# EAGLE board ArduinoDevBoardRevA (EAGLE 8.7.1), part 1 of 2
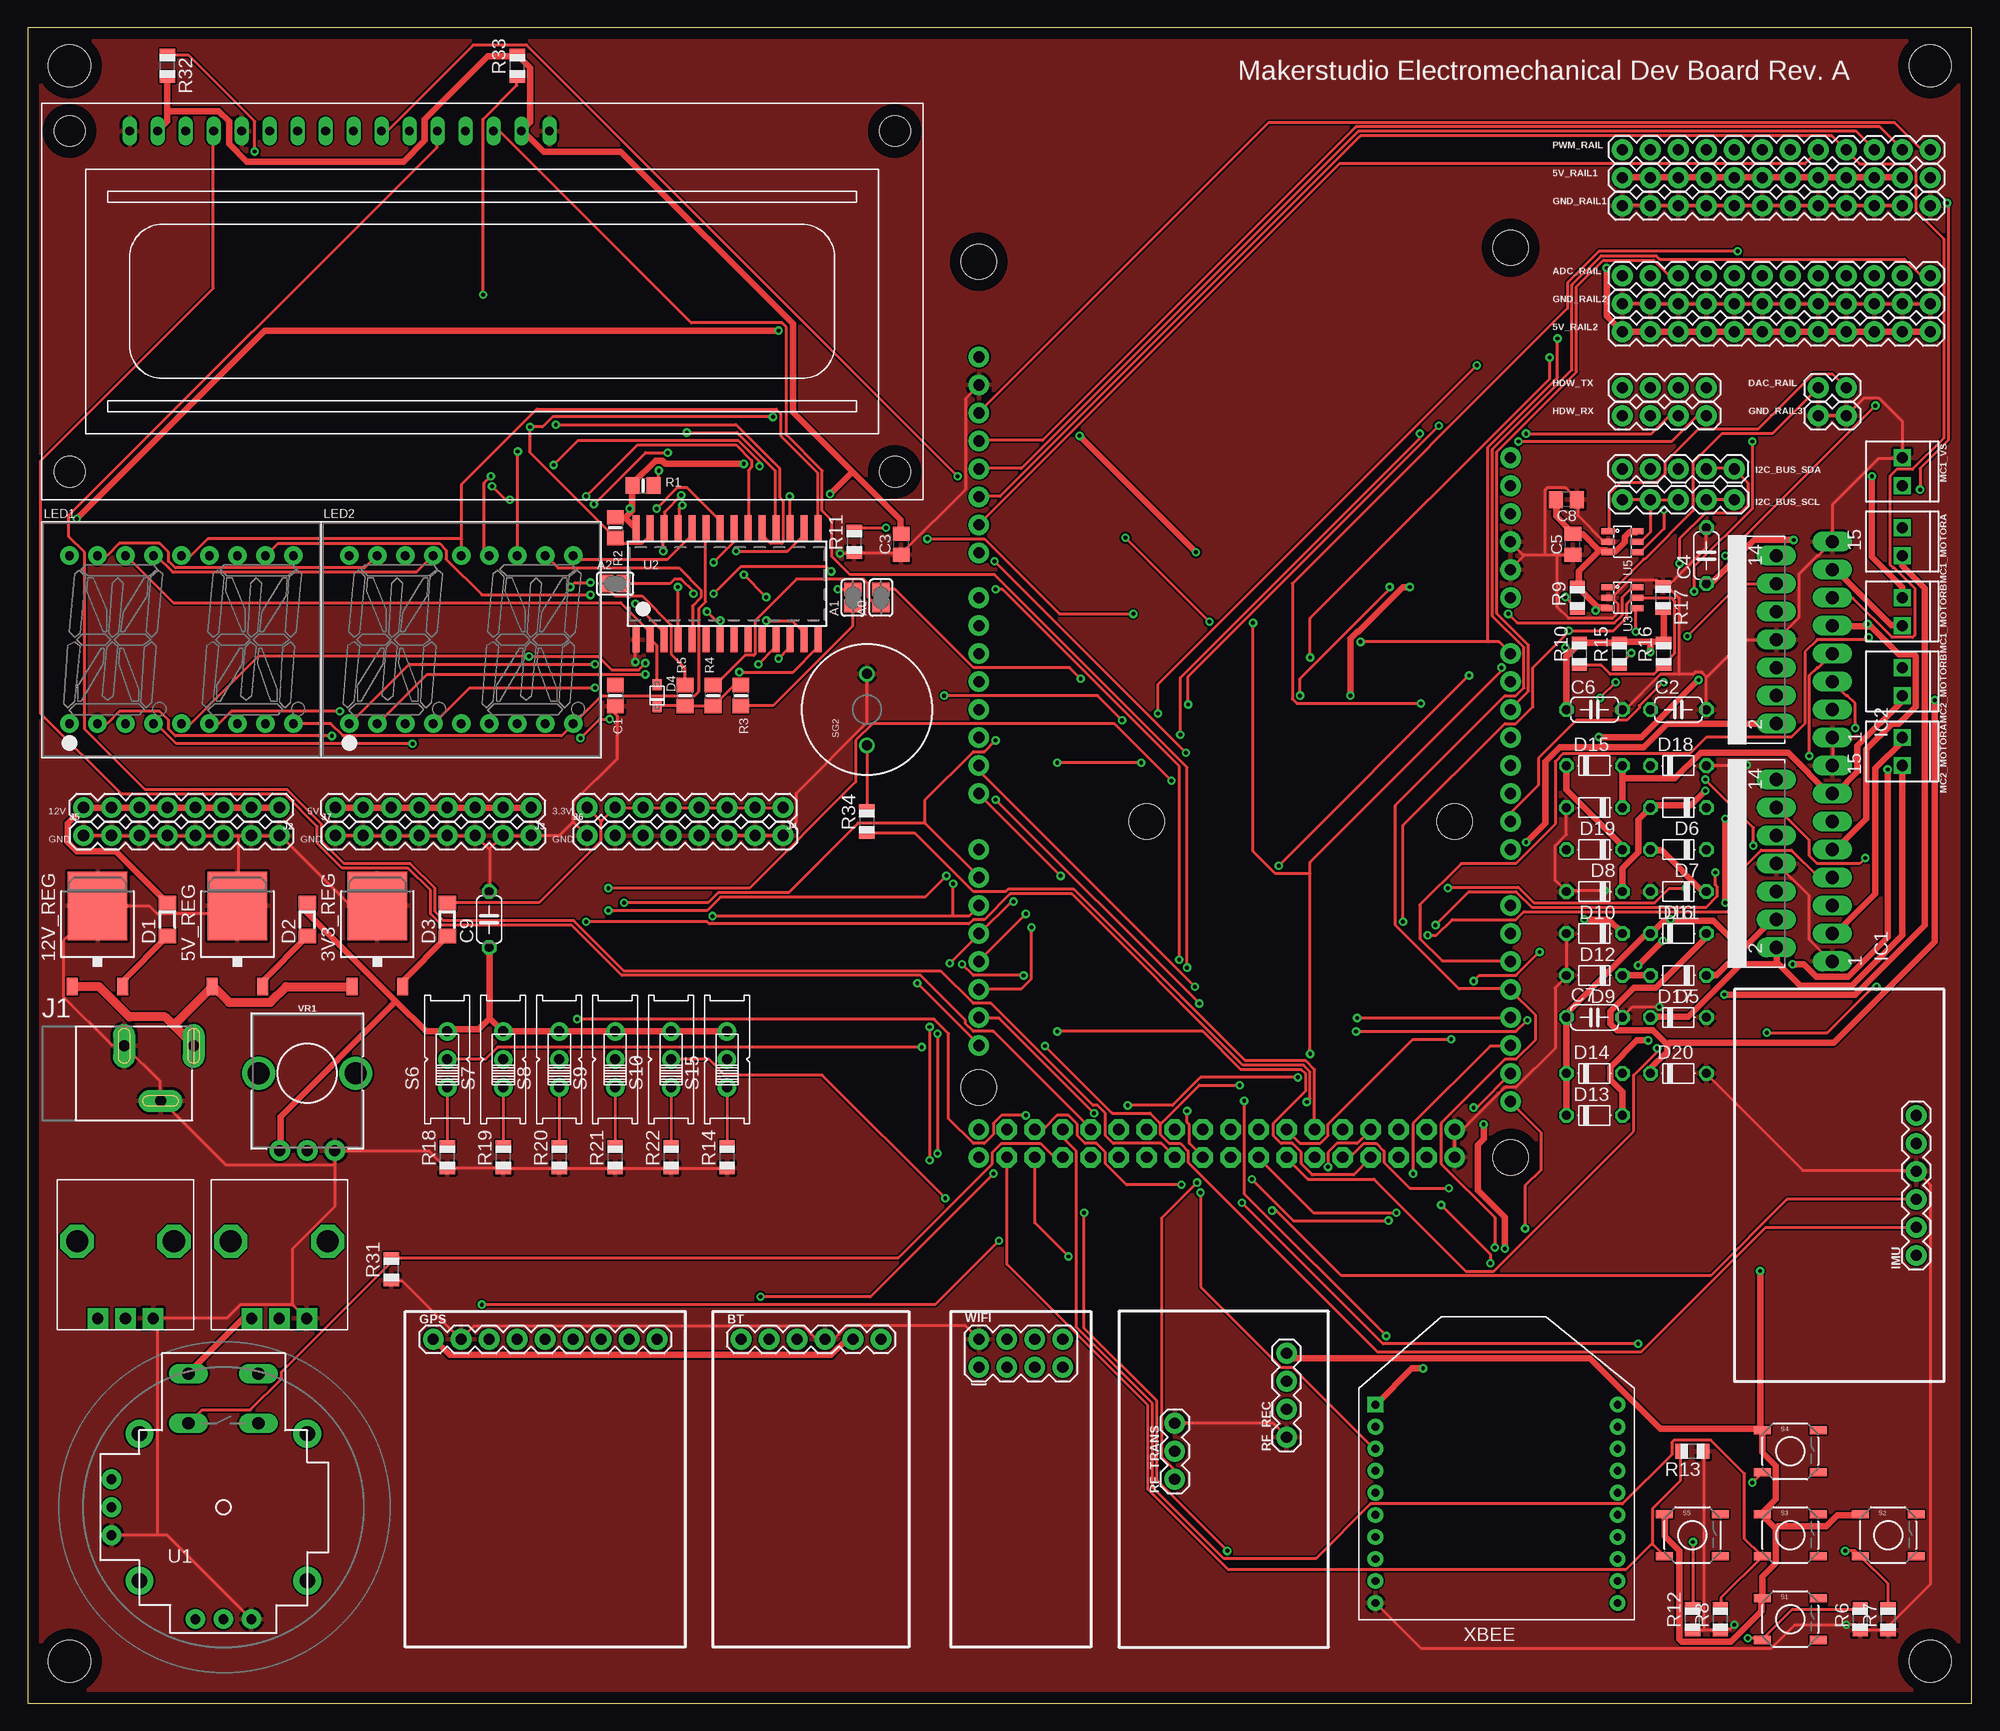
[diagram p2: board, top side]
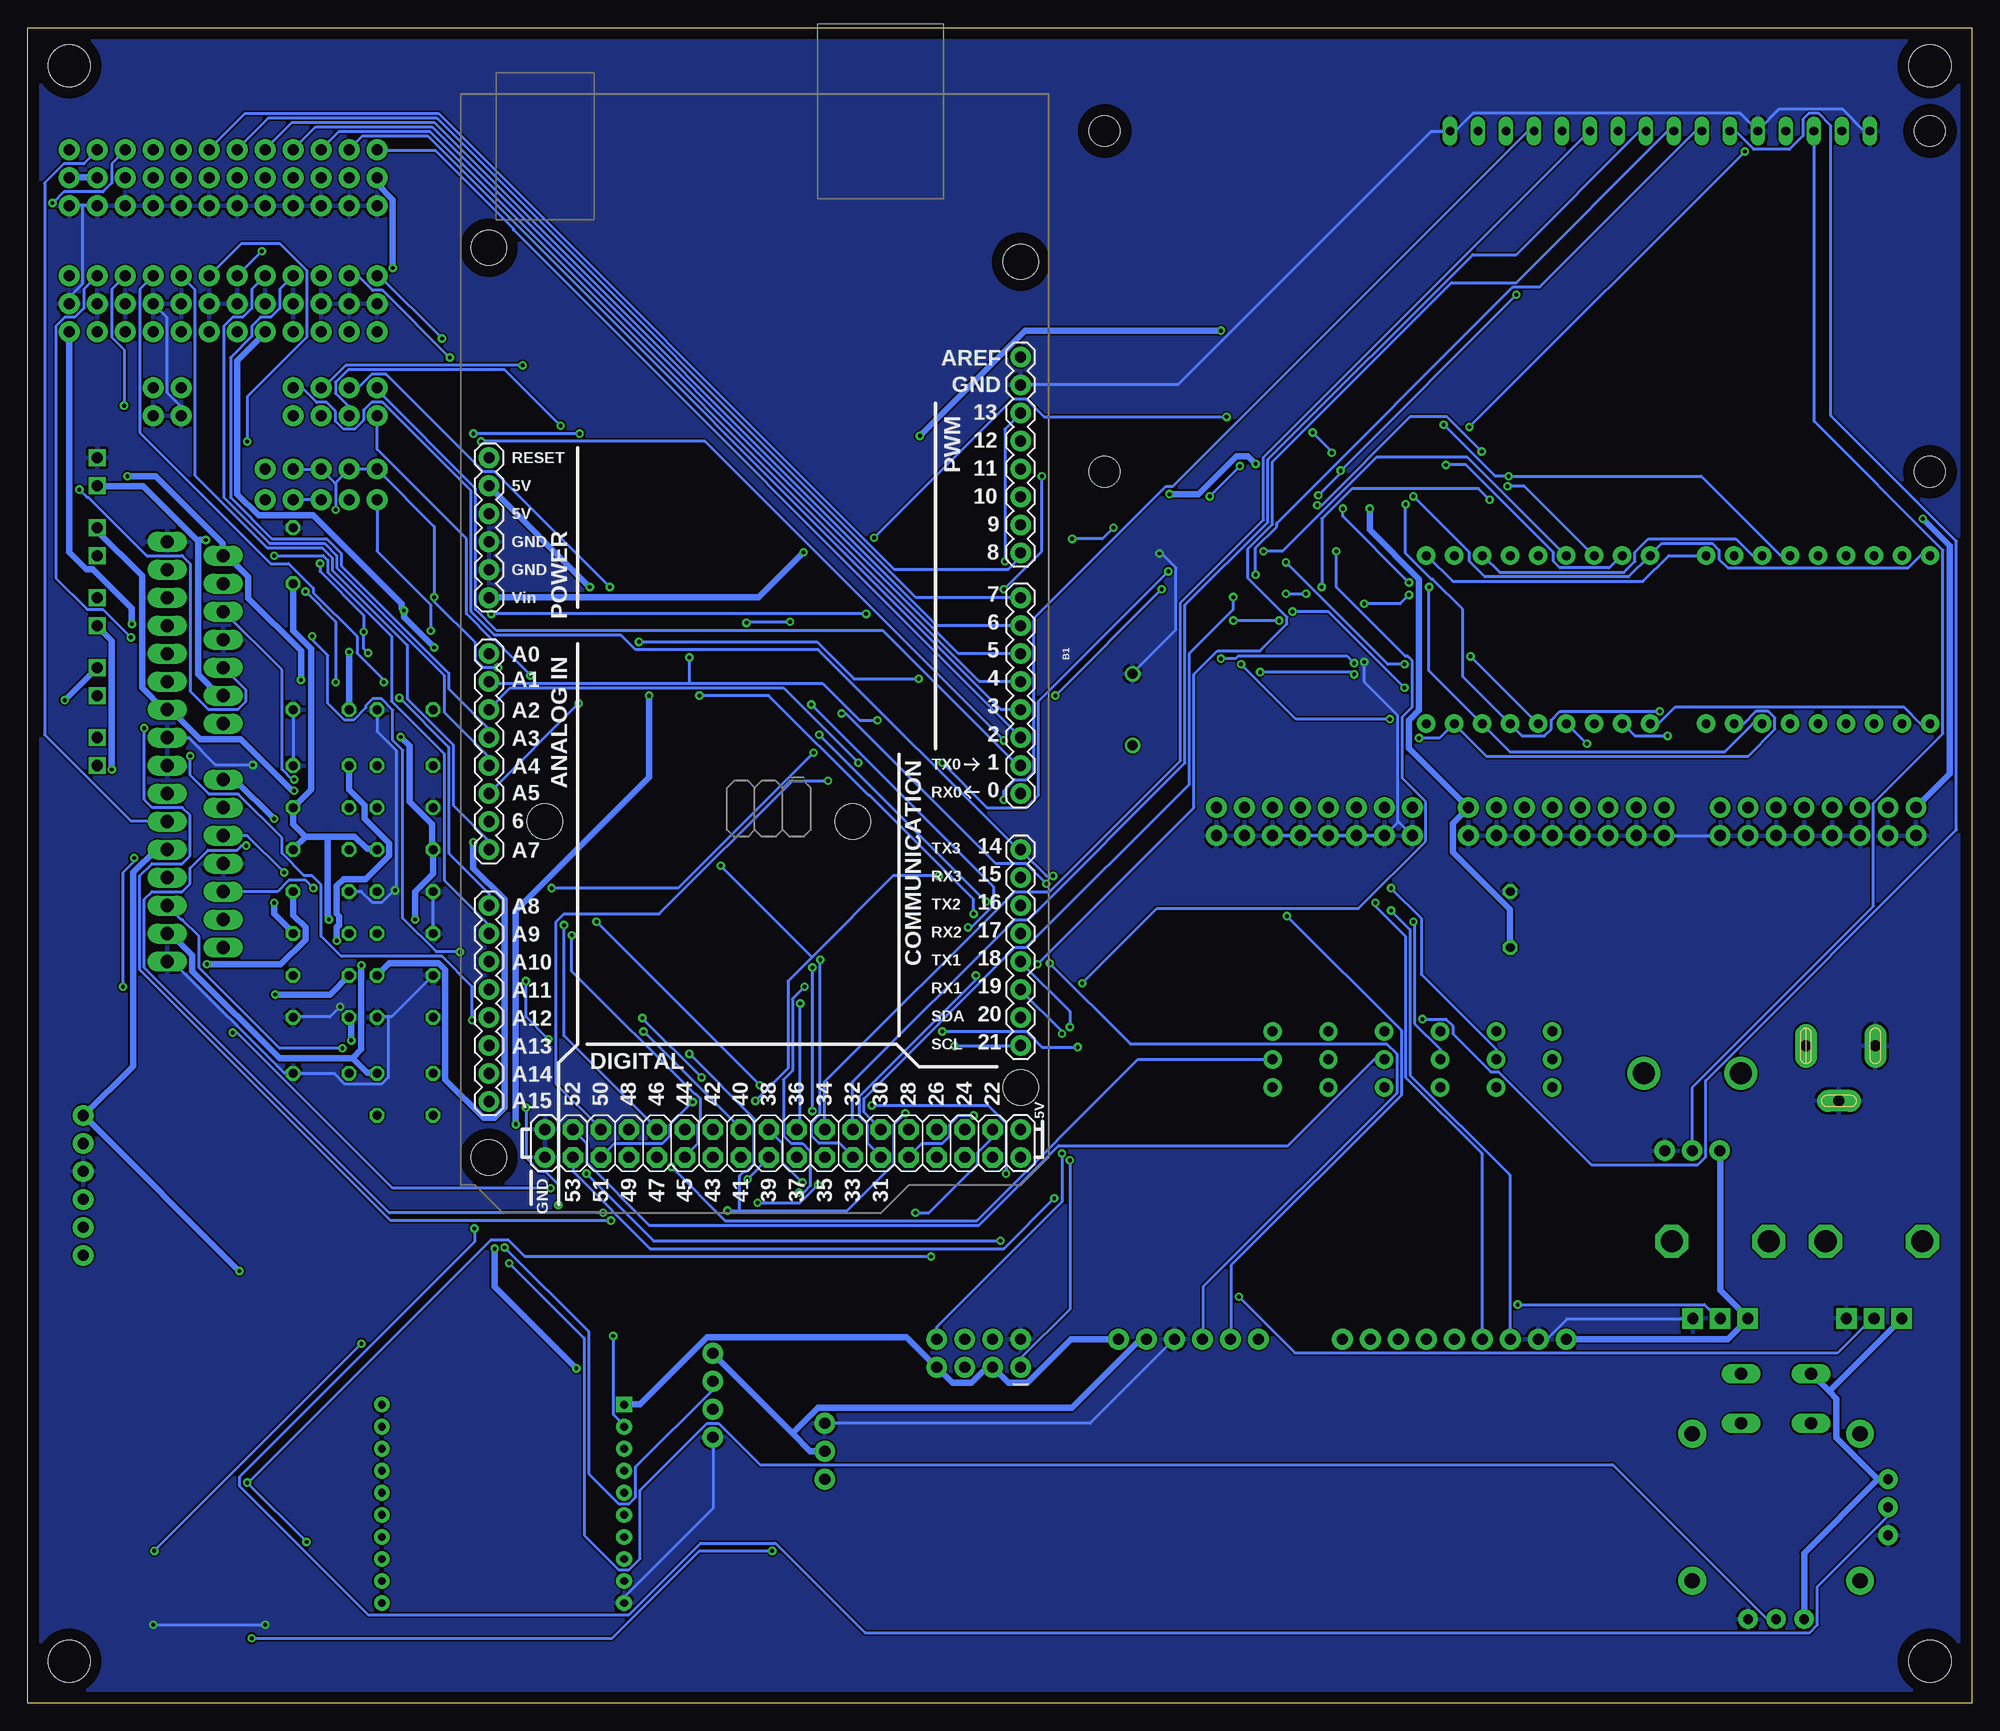
[diagram p3: board, bottom side, seen from below]

Size 176.51 x 152.07 mm. Coordinates in mm from the lower left corner, seen from the top.
Outline: 0,0 176.51,0 176.51,152.07 0,152.07 0,0
Copper layers (1*16): Top 0.035mm / dielectric 1.5mm / Bottom 0.035mm
Design rules "default": minimum track width 6mil, minimum drill 0.35mm, track to track 6mil, track to pad 6mil, pad to pad 6mil, via to via 6mil, smd to smd 6mil, copper to edge 40mil, drill to drill 6mil, minimum pad ring 10mil, minimum via ring 8mil, stop-mask expansion 4mil, vias tented up to drill 0mil, thermal gap 10mil
Net classes: 0 default: width 0.254 mm; 1 5V: width 0.61 mm; 2 3.3V: width 0.61 mm; 3 12V: width 0.61 mm; 4 VIN: width 0.813 mm
Holes 3.81 mm at 3.81,148.59 172.72,148.59 172.72,3.81 3.81,3.81

## Footprints (pad centres in the part's own frame; a part is rotated, then mirrored left to right if it is on the bottom)
TO252 = smd 1 x 1.6: 1 -2.28,-4.8; 2 2.28,-4.8 | smd 5.4 x 6.2: 3 0,2.5
1X12 = drill 1.016 pad 1.88: 1 0,0; 2 2.54,0; 3 5.08,0; 4 7.62,0; 5 10.16,0; 6 12.7,0; 7 15.24,0; 8 17.78,0; 9 20.32,0; 10 22.86,0; 11 25.4,0; 12 27.94,0
SOLDERJUMPER_REFLOW_NOPASTE = smd 1.168 x 1.6: 1 -0.762,0; 2 0.762,0
ARDUINO_MEGA = drill 1.016 pad 1.88: 0 13.97,24.13; 1 11.43,24.13; 2 8.89,24.13; 3 6.35,24.13; 3.3V -13.97,-24.13; 4 3.81,24.13; 5 1.27,24.13; 5V@0 -11.43,-24.13; 5V@1 44.45,24.13; 5V@2 46.99,24.13; 6 -1.27,24.13; 7 -3.81,24.13; 8 -7.874,24.13; 9 -10.414,24.13; 10 -12.954,24.13; 11 -15.494,24.13; 12 -18.034,24.13; 13 -20.574,24.13; 14 19.05,24.13; 15 21.59,24.13; 16 24.13,24.13; 17 26.67,24.13; 18 29.21,24.13; 19 31.75,24.13; 20 34.29,24.13; 21 36.83,24.13; A0 1.27,-24.13; A1 3.81,-24.13; A2 6.35,-24.13; A3 8.89,-24.13; A4 11.43,-24.13; A5 13.97,-24.13; A6 16.51,-24.13; A7 19.05,-24.13; A8 24.13,-24.13; A9 26.67,-24.13; A10 29.21,-24.13; A11 31.75,-24.13; A12 34.29,-24.13; A13 36.83,-24.13; A14 39.37,-24.13; A15 41.91,-24.13; AREF -25.654,24.13; GND@0 -8.89,-24.13; GND@1 -6.35,-24.13; GND@2 44.45,-19.05; GND@3 46.99,-19.05; GND@4 -23.114,24.13; RESET -16.51,-24.13; VIN -3.81,-24.13 | drill 1.016 pad 1.88 octagon: 22 44.45,21.59; 23 46.99,21.59; 24 44.45,19.05; 25 46.99,19.05; 26 44.45,16.51; 27 46.99,16.51; 28 44.45,13.97; 29 46.99,13.97; 30 44.45,11.43; 31 46.99,11.43; 32 44.45,8.89; 33 46.99,8.89; 34 44.45,6.35; 35 46.99,6.35; 36 44.45,3.81; 37 46.99,3.81; 38 44.45,1.27; 39 46.99,1.27; 40 44.45,-1.27; 41 46.99,-1.27; 42 44.45,-3.81; 43 46.99,-3.81; 44 44.45,-6.35; 45 46.99,-6.35; 46 44.45,-8.89; 47 46.99,-8.89; 48 44.45,-11.43; 49 46.99,-11.43; 50 44.45,-13.97; 51 46.99,-13.97; 52 44.45,-16.51; 53 46.99,-16.51 | hole 3.2: -34.29,24.13; -35.56,-24.13; 16.51,8.89; 16.51,-19.05; 40.64,24.13; 46.99,-24.13
1X06 = drill 1.016 pad 1.88: 1 0,0; 2 2.54,0; 3 5.08,0; 4 7.62,0; 5 10.16,0; 6 12.7,0
0805-NO = smd 1.3 x 1.5: 1 -0.95,0; 2 0.95,0
C050-024X044 = drill 0.813 octagon: 1 -2.54,0; 2 2.54,0
0805 = smd 1.27 x 1.524: 1 -0.953,0; 2 0.953,0
SOD-123 = smd 1.3 x 1.6: 1 -1.5,0; 2 1.5,0
SOD-323F = smd 1 x 0.8: A -1,0; C 1,0
D-5 = drill 0.813 octagon: A 2.54,0; C -2.54,0
1X02 = drill 1.016 pad 1.88: 1 0,0; 2 2.54,0
1X09 = drill 1.016 pad 1.88: 1 0,0; 2 2.54,0; 3 5.08,0; 4 7.62,0; 5 10.16,0; 6 12.7,0; 7 15.24,0; 8 17.78,0; 9 20.32,0
1X04 = drill 1.016 pad 1.88: 1 0,0; 2 2.54,0; 3 5.08,0; 4 7.62,0
1X05 = drill 1.016 pad 1.88: 1 0,0; 2 2.54,0; 3 5.08,0; 4 7.62,0; 5 10.16,0
MULTIWATT-15 = drill 1.2 long: 1 -8.89,-7.62; 2 -7.62,-2.54; 3 -6.35,-7.62; 4 -5.08,-2.54; 5 -3.81,-7.62; 6 -2.54,-2.54; 7 -1.27,-7.62; 8 0,-2.54; 9 1.27,-7.62; 10 2.54,-2.54; 11 3.81,-7.62; 12 5.08,-2.54; 13 6.35,-7.62; 14 7.62,-2.54; 15 8.89,-7.62
POWER_JACK_SLOT = drill 1 pad 2 long: GND@1 2.58,7.5; GND@2 7.58,10.8; PWR 2.58,13.8
1X08 = drill 1.016 pad 1.88: 1 0,0; 2 2.54,0; 3 5.08,0; 4 7.62,0; 5 10.16,0; 6 12.7,0; 7 15.24,0; 8 17.78,0
SEGMENT_STARTBUST_DUAL_KWA-541CBB = drill 0.8 pad 1.676: 1 -10.16,-7.62; 2 -7.62,-7.62; 3 -5.08,-7.62; 4 -2.54,-7.62; 5 0,-7.62; 6 2.54,-7.62; 7 5.08,-7.62; 8 7.62,-7.62; 9 10.16,-7.62; 10 10.16,7.62; 11 7.62,7.62; 12 5.08,7.62; 13 2.54,7.62; 14 0,7.62; 15 -2.54,7.62; 16 -5.08,7.62; 17 -7.62,7.62; 18 -10.16,7.62
1X02_2.54_SCREWTERM = drill 1.016 square: P1 2.54,0; P2 0,0
R0805 = smd 1.1 x 1.4: 1 -1,0; 2 1,0
1X03 = drill 1.016 pad 1.88: 1 0,0; 2 2.54,0; 3 5.08,0
TACTILE_SWITCH_SMD = smd 1.524 x 0.762: 1 -2.54,1.905; 2 2.54,1.905; 3 -2.54,-1.905; 4 2.54,-1.905
EG1218 = drill 0.9 pad 1.676: O -2.54,0; P 0,0; S 2.54,0
BUZZER-12MM = drill 0.9: + 3.25,0; - -3.25,0
JOYSTICK = drill 1.1 pad 1.778 long: B1A -3.175,12.12; B1B 3.175,12.12; B2A -3.175,7.62; B2B 3.175,7.62 | drill 0.889 pad 1.778: H1 -2.54,-10.16; H2 0,-10.16; H3 2.54,-10.16; V1 -10.16,2.54; V2 -10.16,0; V3 -10.16,-2.54 | drill 1.397 pad 2.54: MOUNT1 -7.62,6.668; MOUNT2 -7.62,-6.668; MOUNT3 7.62,-6.668; MOUNT4 7.62,6.668
SOP28_300MIL = smd 0.635 x 2.286: P$1 -8.255,-5.08; P$2 -6.985,-5.08; P$3 -5.715,-5.08; P$4 -4.445,-5.08; P$5 -3.175,-5.08; P$6 -1.905,-5.08; P$7 -0.635,-5.08; P$8 0.635,-5.08; P$9 1.905,-5.08; P$10 3.175,-5.08; P$11 4.445,-5.08; P$12 5.715,-5.08; P$13 6.985,-5.08; P$14 8.255,-5.08; P$15 8.255,5.08; P$16 6.985,5.08; P$17 5.715,5.08; P$18 4.445,5.08; P$19 3.175,5.08; P$20 1.905,5.08; P$21 0.635,5.08; P$22 -0.635,5.08; P$23 -1.905,5.08; P$24 -3.175,5.08; P$25 -4.445,5.08; P$26 -5.715,5.08; P$27 -6.985,5.08; P$28 -8.255,5.08
SOT23-6 = smd 0.55 x 1.2: 1 -0.95,-1.3; 2 0,-1.3; 3 0.95,-1.3; 4 0.95,1.3; 5 0,1.3; 6 -0.95,1.3
ALPS_POT = drill 1 pad 1.88 square: P$1 7,-2.5; P$2 7,0; P$3 7,2.5 | drill 2 octagon: P$4 0,-4.4; P$5 0,4.4
POT-PTH-ALPS-KIT = drill 1 pad 1.88: P$1 7,-2.5; P$2 7,0; P$3 7,2.5 | drill 2: P$4 0,-4.4; P$5 0,4.4
2X4 = drill 1.016 pad 1.88: 1 -3.81,-1.27; 2 -3.81,1.27; 3 -1.27,-1.27; 4 -1.27,1.27; 5 1.27,-1.27; 6 1.27,1.27; 7 3.81,-1.27; 8 3.81,1.27
LCD1602 = drill 0.8 long: 1 8,33.46; 2 10.54,33.46; 3 13.08,33.46; 4 15.62,33.46; 5 18.16,33.46; 6 20.7,33.46; 7 23.24,33.46; 8 25.78,33.46; 9 28.32,33.46; 10 30.86,33.46; 11 33.4,33.46; 12 35.94,33.46; 13 38.48,33.46; 14 41.02,33.46; 15 43.56,33.46; 16 46.1,33.46 | hole 2.8: 2.54,2.54; 2.54,33.46; 77.46,33.46; 77.46,2.54
XBEE = drill 0.7 pad 1.422 square: 1 -11,5.5 | drill 0.7 pad 1.422: 2 -11,3.5; 3 -11,1.5; 4 -11,-0.5; 5 -11,-2.5; 6 -11,-4.5; 7 -11,-6.5; 8 -11,-8.5; 9 -11,-10.5; 10 -11,-12.5; 11 11,-12.5; 12 11,-10.5; 13 11,-8.5; 14 11,-6.5; 15 11,-4.5; 16 11,-2.5; 17 11,-0.5; 18 11,1.5; 19 11,3.5; 20 11,5.5

## Placement (x,y rotation side)
3V3_REG  7812DT  [TO252]  31.75,69.85 0 top
5V_RAIL1  [1X12]  144.78,138.43 0 top
5V_RAIL2  [1X12]  144.78,124.46 0 top
5V_REG  7812DT  [TO252]  19.05,69.85 0 top
12V_REG  7812DT  [TO252]  6.35,69.85 0 top
A0  [SOLDERJUMPER_REFLOW_NOPASTE]  77.47,100.33 90 top
A1  [SOLDERJUMPER_REFLOW_NOPASTE]  74.93,100.33 90 top
A2  [SOLDERJUMPER_REFLOW_NOPASTE]  53.34,101.6 0 top
ADC_RAIL  [1X12]  144.78,129.54 0 top
B1  ARDUINO_MEGA_R3FULL  [ARDUINO_MEGA]  110.49,96.52 270 bottom
BT  [1X06]  64.77,33.02 0 top
C1  10uF  [0805-NO]  53.34,91.44 270 top
C2  100nF  [C050-024X044]  149.86,90.17 0 top
C3  0.1uF  [0805]  79.31,105.18 90 top
C4  100nF  [C050-024X044]  152.4,104.14 90 top
C5  0.1uF  [0805]  140.27,105.18 90 top
C6  100nF  [C050-024X044]  142.24,90.17 0 top
C7  100nF  [C050-024X044]  142.24,62.23 0 top
C8  0.1uF  [0805]  139.7,109.22 180 top
C9  4.7uF  [C050-024X044]  41.91,71.12 90 top
D1  [SOD-123]  12.7,71.12 90 top
D2  [SOD-123]  25.4,71.12 90 top
D3  [SOD-123]  38.1,71.12 90 top
D4  1N4148  [SOD-323F]  57.15,91.44 270 top
D5  [D-5]  149.86,66.04 180 top
D6  [D-5]  149.86,81.28 180 top
D7  [D-5]  149.86,77.47 180 top
D8  [D-5]  142.24,77.47 180 top
D9  [D-5]  142.24,66.04 180 top
D10  [D-5]  142.24,73.66 180 top
D11  [D-5]  149.86,73.66 180 top
D12  [D-5]  142.24,69.85 180 top
D13  [D-5]  142.24,53.34 0 top
D14  [D-5]  142.24,57.15 0 top
D15  [D-5]  142.24,85.09 0 top
D16  [D-5]  149.86,69.85 0 top
D17  [D-5]  149.86,62.23 0 top
D18  [D-5]  149.86,85.09 0 top
D19  [D-5]  142.24,81.28 180 top
D20  [D-5]  149.86,57.15 0 top
DAC_RAIL  [1X02]  162.56,119.38 0 top
GND_RAIL1  [1X12]  144.78,135.89 0 top
GND_RAIL2  [1X12]  144.78,127 0 top
GND_RAIL3  [1X02]  162.56,116.84 0 top
GPS  [1X09]  36.83,33.02 0 top
HDW_RX  [1X04]  144.78,116.84 0 top
HDW_TX  [1X04]  144.78,119.38 0 top
I2C_BUS_SCL  [1X05]  144.78,109.22 0 top
I2C_BUS_SDA  [1X05]  154.94,112.01 180 top
IC1  L298  [MULTIWATT-15]  156.21,76.2 90 top
IC2  L298  [MULTIWATT-15]  156.21,96.52 90 top
IMU  [1X06]  171.45,40.64 90 top
J1  POWER_JACKSLT  [POWER_JACK_SLOT]  1.27,62.23 270 top
J2  [1X08]  22.86,81.28 180 top
J3  [1X08]  45.72,81.28 180 top
J4  [1X08]  68.58,81.28 180 top
J5  [1X08]  5.08,78.74 0 top
J6  [1X08]  50.8,78.74 0 top
J7  [1X08]  27.94,78.74 0 top
LED1  [SEGMENT_STARTBUST_DUAL_KWA-541CBB]  13.97,96.52 0 top
LED2  [SEGMENT_STARTBUST_DUAL_KWA-541CBB]  39.37,96.52 0 top
MC1_MOTORA  [1X02_2.54_SCREWTERM]  170.18,106.68 270 top
MC1_MOTORB  [1X02_2.54_SCREWTERM]  170.18,100.33 270 top
MC1_VS  [1X02_2.54_SCREWTERM]  170.18,113.03 270 top
MC2_MOTORA  [1X02_2.54_SCREWTERM]  170.18,87.63 270 top
MC2_MOTORB  [1X02_2.54_SCREWTERM]  170.18,93.98 270 top
PWM_RAIL  [1X12]  144.78,140.97 0 top
R1  10K  [0805-NO]  55.88,110.49 0 top
R2  10K  [0805-NO]  53.34,106.68 270 top
R3  47K  [0805-NO]  64.77,91.44 270 top
R4  47K  [0805-NO]  62.23,91.44 90 top
R5  47K  [0805-NO]  59.69,91.44 90 top
R6  [R0805]  166.37,7.62 90 top
R7  [R0805]  168.91,7.62 90 top
R8  [R0805]  153.67,7.62 90 top
R9  10k  [R0805]  140.69,100.32 90 top
R10  10k  [R0805]  140.87,95.25 90 top
R11  10k  [R0805]  75.05,105.4 90 top
R12  [R0805]  151.13,7.62 90 top
R13  [R0805]  151.13,22.86 180 top
R14  10K  [R0805]  63.5,49.53 90 top
R15  10k  [R0805]  144.5,95.24 90 top
R16  10k  [R0805]  148.51,95.24 90 top
R17  10k  [R0805]  148.47,100.34 270 top
R18  10K  [R0805]  38.1,49.53 90 top
R19  10K  [R0805]  43.18,49.53 90 top
R20  10K  [R0805]  48.26,49.53 90 top
R21  10K  [R0805]  53.34,49.53 90 top
R22  10K  [R0805]  58.42,49.53 90 top
R31  10k  [R0805]  33.02,39.37 90 top
R32  10k  [R0805]  12.7,148.59 270 top
R33  10k  [R0805]  44.45,148.59 90 top
R34  100  [R0805]  76.2,80.01 90 top
RF_REC  [1X04]  114.3,24.13 90 top
RF_TRANS  [1X03]  104.14,20.32 90 top
S1  [TACTILE_SWITCH_SMD]  160.02,7.62 0 top
S2  [TACTILE_SWITCH_SMD]  168.91,15.24 0 top
S3  [TACTILE_SWITCH_SMD]  160.02,15.24 0 top
S4  [TACTILE_SWITCH_SMD]  160.02,22.86 0 top
S5  [TACTILE_SWITCH_SMD]  151.13,15.24 0 top
S6  [EG1218]  38.1,58.42 90 top
S7  [EG1218]  43.18,58.42 90 top
S8  [EG1218]  48.26,58.42 90 top
S9  [EG1218]  53.34,58.42 90 top
S10  [EG1218]  58.42,58.42 90 top
S15  [EG1218]  63.5,58.42 90 top
SG2  BUZZERPTH  [BUZZER-12MM]  76.2,90.17 90 top
U1  JOYSTICKPTH  [JOYSTICK]  17.78,17.78 0 top
U2  [SOP28_300MIL]  63.5,101.6 0 top
U3  MCP4725A1T-E/CH  [SOT23-6]  144.78,100.33 270 top
U5  MCP4725A1T-E/CH  [SOT23-6]  144.78,105.41 270 top
U$12  POT  [ALPS_POT]  22.86,41.91 270 top
U$14  POT  [ALPS_POT]  8.89,41.91 270 top
VR1  10k  [POT-PTH-ALPS-KIT]  25.4,57.15 270 top
WIFI  [2X4]  90.17,31.75 0 top
X1  HD44780LCD-1602  [LCD1602]  1.27,109.22 0 top
XBEE  XBEE  [XBEE]  133.35,21.59 0 top